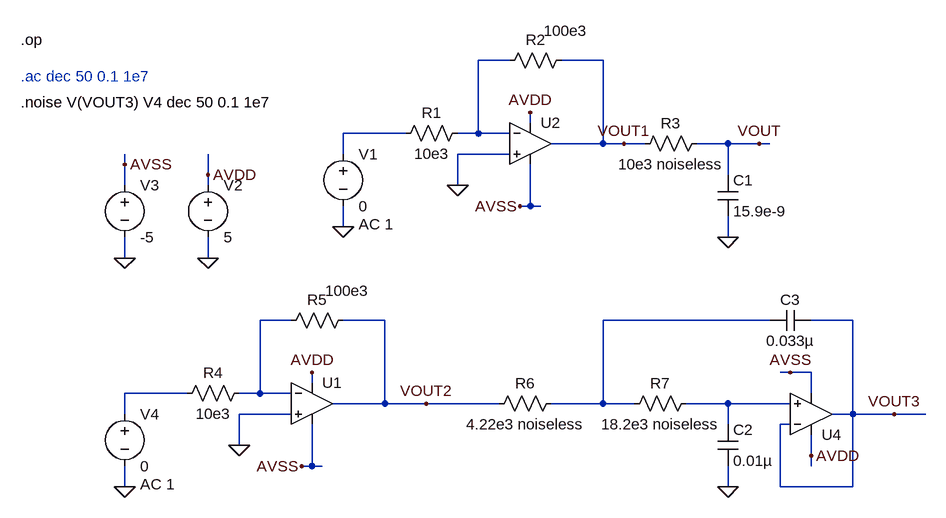
[diagram p0: schematic Opamp_noise_2nd_Filter.asc]
Opamp_noise_2nd_Filter.asc, the LTspice schematic file:
Version 4
SHEET 1 1220 680
WIRE 112 -32 64 -32
WIRE 256 -32 192 -32
WIRE 144 64 144 48
WIRE -48 80 -144 80
WIRE 64 80 64 -32
WIRE 64 80 32 80
WIRE 112 80 64 80
WIRE 256 96 256 -32
WIRE 256 96 176 96
WIRE 288 96 256 96
WIRE 320 96 288 96
WIRE 448 96 400 96
WIRE 496 96 448 96
WIRE 512 96 496 96
WIRE -144 112 -144 80
WIRE 112 112 32 112
WIRE -480 128 -480 112
WIRE -352 144 -352 112
WIRE 448 144 448 96
WIRE -480 160 -480 128
WIRE -352 160 -352 144
WIRE 32 160 32 112
WIRE 144 192 144 128
WIRE 144 192 128 192
WIRE 160 192 144 192
WIRE -144 224 -144 192
WIRE 448 240 448 208
WIRE -480 272 -480 240
WIRE -352 272 -352 240
WIRE -224 368 -272 368
WIRE -80 368 -144 368
WIRE 512 368 256 368
WIRE 640 368 576 368
WIRE 544 448 528 448
WIRE 576 448 544 448
WIRE -192 464 -192 448
WIRE -384 480 -480 480
WIRE -272 480 -272 368
WIRE -272 480 -304 480
WIRE -224 480 -272 480
WIRE 576 480 576 448
WIRE -80 496 -80 368
WIRE -80 496 -160 496
WIRE -16 496 -80 496
WIRE 96 496 -16 496
WIRE 256 496 256 368
WIRE 256 496 176 496
WIRE 304 496 256 496
WIRE 448 496 384 496
WIRE 544 496 448 496
WIRE -480 512 -480 480
WIRE -224 512 -304 512
WIRE 640 512 640 368
WIRE 640 512 608 512
WIRE 704 512 640 512
WIRE 752 512 704 512
WIRE 448 528 448 496
WIRE 544 528 528 528
WIRE -304 560 -304 512
WIRE 576 576 576 544
WIRE -192 592 -192 528
WIRE -192 592 -208 592
WIRE -176 592 -192 592
WIRE 576 592 576 576
WIRE -480 624 -480 592
WIRE 448 624 448 592
WIRE 528 624 528 528
WIRE 640 624 640 512
WIRE 640 624 528 624
FLAG -352 272 0
FLAG -352 144 AVDD
FLAG -480 272 0
FLAG -480 128 AVSS
FLAG -192 448 AVDD
FLAG -208 592 AVSS
FLAG -16 496 VOUT2
FLAG -304 560 0
FLAG -480 624 0
FLAG 448 624 0
FLAG 544 448 AVSS
FLAG 576 576 AVDD
FLAG 704 512 VOUT3
FLAG 144 48 AVDD
FLAG 128 192 AVSS
FLAG 32 160 0
FLAG -144 224 0
FLAG 448 240 0
FLAG 496 96 VOUT
FLAG 288 96 VOUT1
DATAFLAG -480 128 ""
DATAFLAG -352 128 ""
DATAFLAG -288 480 ""
DATAFLAG -112 496 ""
DATAFLAG 48 80 ""
DATAFLAG 224 96 ""
SYMBOL voltage -352 144 R0
WINDOW 123 0 0 Left 0
WINDOW 39 0 0 Left 0
SYMATTR InstName V2
SYMATTR Value 5
SYMBOL voltage -480 144 R0
WINDOW 123 0 0 Left 0
WINDOW 39 0 0 Left 0
SYMATTR InstName V3
SYMATTR Value -5
SYMBOL voltage -480 496 R0
WINDOW 123 24 124 Left 2
WINDOW 39 0 0 Left 0
SYMATTR Value2 AC 1
SYMATTR InstName V4
SYMATTR Value 0
SYMBOL res -288 464 R90
WINDOW 0 0 56 VBottom 2
WINDOW 3 32 56 VTop 2
SYMATTR InstName R4
SYMATTR Value 10e3
SYMBOL res -128 352 R90
WINDOW 0 0 56 VBottom 2
WINDOW 3 -45 10 VTop 2
SYMATTR InstName R5
SYMATTR Value 100e3
SYMBOL res 192 480 R90
WINDOW 0 0 56 VBottom 2
WINDOW 3 32 56 VTop 2
SYMATTR InstName R6
SYMATTR Value 4.22e3 noiseless
SYMBOL res 400 480 R90
WINDOW 0 0 56 VBottom 2
WINDOW 3 32 56 VTop 2
SYMATTR InstName R7
SYMATTR Value 18.2e3 noiseless
SYMBOL cap 432 528 R0
SYMATTR InstName C2
SYMATTR Value 0.01µ
SYMBOL cap 576 352 R90
WINDOW 0 0 32 VBottom 2
WINDOW 3 32 32 VTop 2
SYMATTR InstName C3
SYMATTR Value 0.033µ
SYMBOL OpAmps\\UniversalOpamp2 576 512 M180
SYMATTR InstName U4
SYMBOL OpAmps\\UniversalOpamp2 -192 496 R0
SYMATTR InstName U1
SYMBOL voltage -144 96 R0
WINDOW 123 24 124 Left 2
WINDOW 39 0 0 Left 0
SYMATTR Value2 AC 1
SYMATTR InstName V1
SYMATTR Value 0
SYMBOL res 48 64 R90
WINDOW 0 0 56 VBottom 2
WINDOW 3 32 56 VTop 2
SYMATTR InstName R1
SYMATTR Value 10e3
SYMBOL res 208 -48 R90
WINDOW 0 0 56 VBottom 2
WINDOW 3 -45 10 VTop 2
SYMATTR InstName R2
SYMATTR Value 100e3
SYMBOL OpAmps\\UniversalOpamp2 144 96 R0
SYMATTR InstName U2
SYMBOL res 416 80 R90
WINDOW 0 0 56 VBottom 2
WINDOW 3 32 56 VTop 2
SYMATTR InstName R3
SYMATTR Value 10e3 noiseless
SYMBOL cap 432 144 R0
SYMATTR InstName C1
SYMATTR Value 15.9e-9
TEXT -640 -64 Left 2 !.op
TEXT -640 -8 Left 2 ;.ac dec 50 0.1 1e7
TEXT -640 32 Left 2 !.noise V(VOUT3) V4 dec 50 0.1 1e7

The netlist it stands for:
* Opamp_noise_2nd_Filter.asc
V2 AVDD 0 5
V3 AVSS 0 -5
V4 N005 0 0 AC 1
R4 N003 N005 10e3
R5 VOUT2 N003 100e3
R6 N004 VOUT2 4.22e3 noiseless
R7 N006 N004 18.2e3 noiseless
C2 N006 0 0.01µ
C3 VOUT3 N004 0.033µ
XU4 N006 VOUT3 AVDD AVSS VOUT3 level.2 Avol=1Meg GBW=10Meg Slew=10Meg ilimit=25m rail=0 Vos=0 phimargin=45 en=0 enk=0 in=0 ink=0 Rin=500Meg  ; pins IN+ IN- V+ V- OUT
XU1 0 N003 AVDD AVSS VOUT2 level.2 Avol=1Meg GBW=10Meg Slew=10Meg ilimit=25m rail=0 Vos=0 phimargin=45 en=0 enk=0 in=0 ink=0 Rin=500Meg  ; pins IN+ IN- V+ V- OUT
V1 N002 0 0 AC 1
R1 N001 N002 10e3
R2 VOUT1 N001 100e3
XU2 0 N001 AVDD AVSS VOUT1 level.2 Avol=1Meg GBW=10Meg Slew=10Meg ilimit=25m rail=0 Vos=0 phimargin=45 en=0 enk=0 in=0 ink=0 Rin=500Meg  ; pins IN+ IN- V+ V- OUT
R3 VOUT VOUT1 10e3 noiseless
C1 VOUT 0 15.9e-9
.op
* .ac dec 50 0.1 1e7
.noise V(VOUT3) V4 dec 50 0.1 1e7
.lib UniversalOpamps2.sub
.backanno
.end